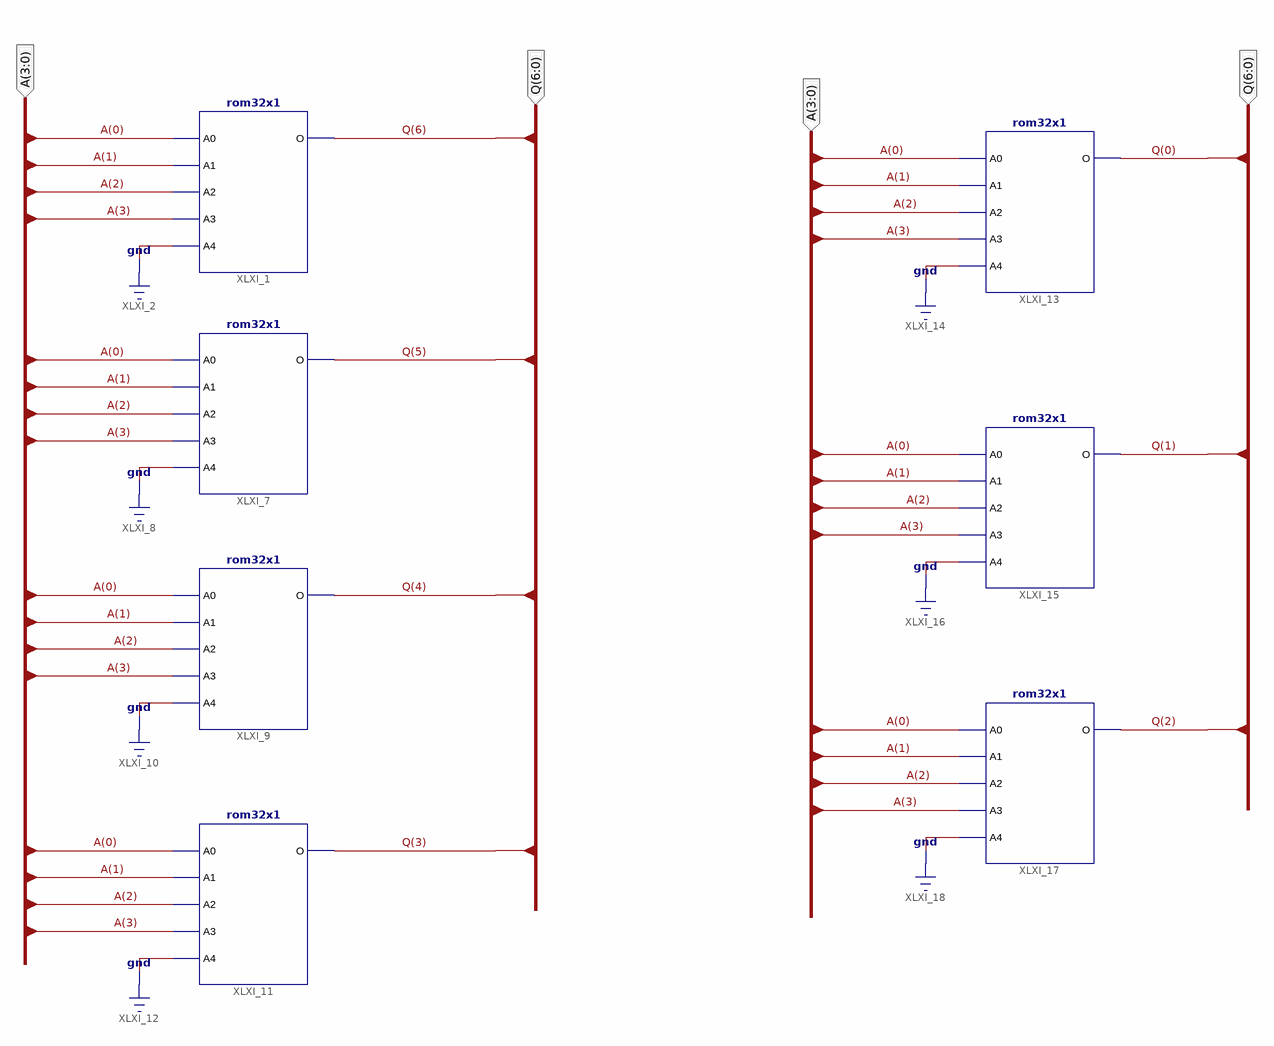
[diagram p0: schematic sheet 1]
// Xilinx ISE schematic my_rom.sch (virtex6) as structural Verilog: 7 symbols, 2 ports
module my_rom (
  input  [3:0] A,
  input  [6:0] Q
);

  rom32x1 #(.INIT("11111111")) XLXI_13 (.A0(A[0]), .A1(A[1]), .A2(A[2]), .A3(A[3]), .A4(1'b0), .O(Q[0]));
  rom32x1 #(.INIT("11111111")) XLXI_15 (.A0(A[0]), .A1(A[1]), .A2(A[2]), .A3(A[3]), .A4(1'b0), .O(Q[1]));
  rom32x1 #(.INIT("11111111")) XLXI_17 (.A0(A[0]), .A1(A[1]), .A2(A[2]), .A3(A[3]), .A4(1'b0), .O(Q[2]));
  rom32x1 #(.INIT("11111111")) XLXI_1 (.A0(A[0]), .A1(A[1]), .A2(A[2]), .A3(A[3]), .A4(1'b0), .O(Q[6]));
  rom32x1 #(.INIT("11111111")) XLXI_7 (.A0(A[0]), .A1(A[1]), .A2(A[2]), .A3(A[3]), .A4(1'b0), .O(Q[5]));
  rom32x1 #(.INIT("11111111")) XLXI_9 (.A0(A[0]), .A1(A[1]), .A2(A[2]), .A3(A[3]), .A4(1'b0), .O(Q[4]));
  rom32x1 #(.INIT("11111111")) XLXI_11 (.A0(A[0]), .A1(A[1]), .A2(A[2]), .A3(A[3]), .A4(1'b0), .O(Q[3]));
endmodule
